# Altium schematic sheet DAC and MIC .SchDoc
size A3; Scale: 1:1; Author: Vishal Y. Bajaj; SheetNumber: 8; SheetTotal: 11; Template: A3
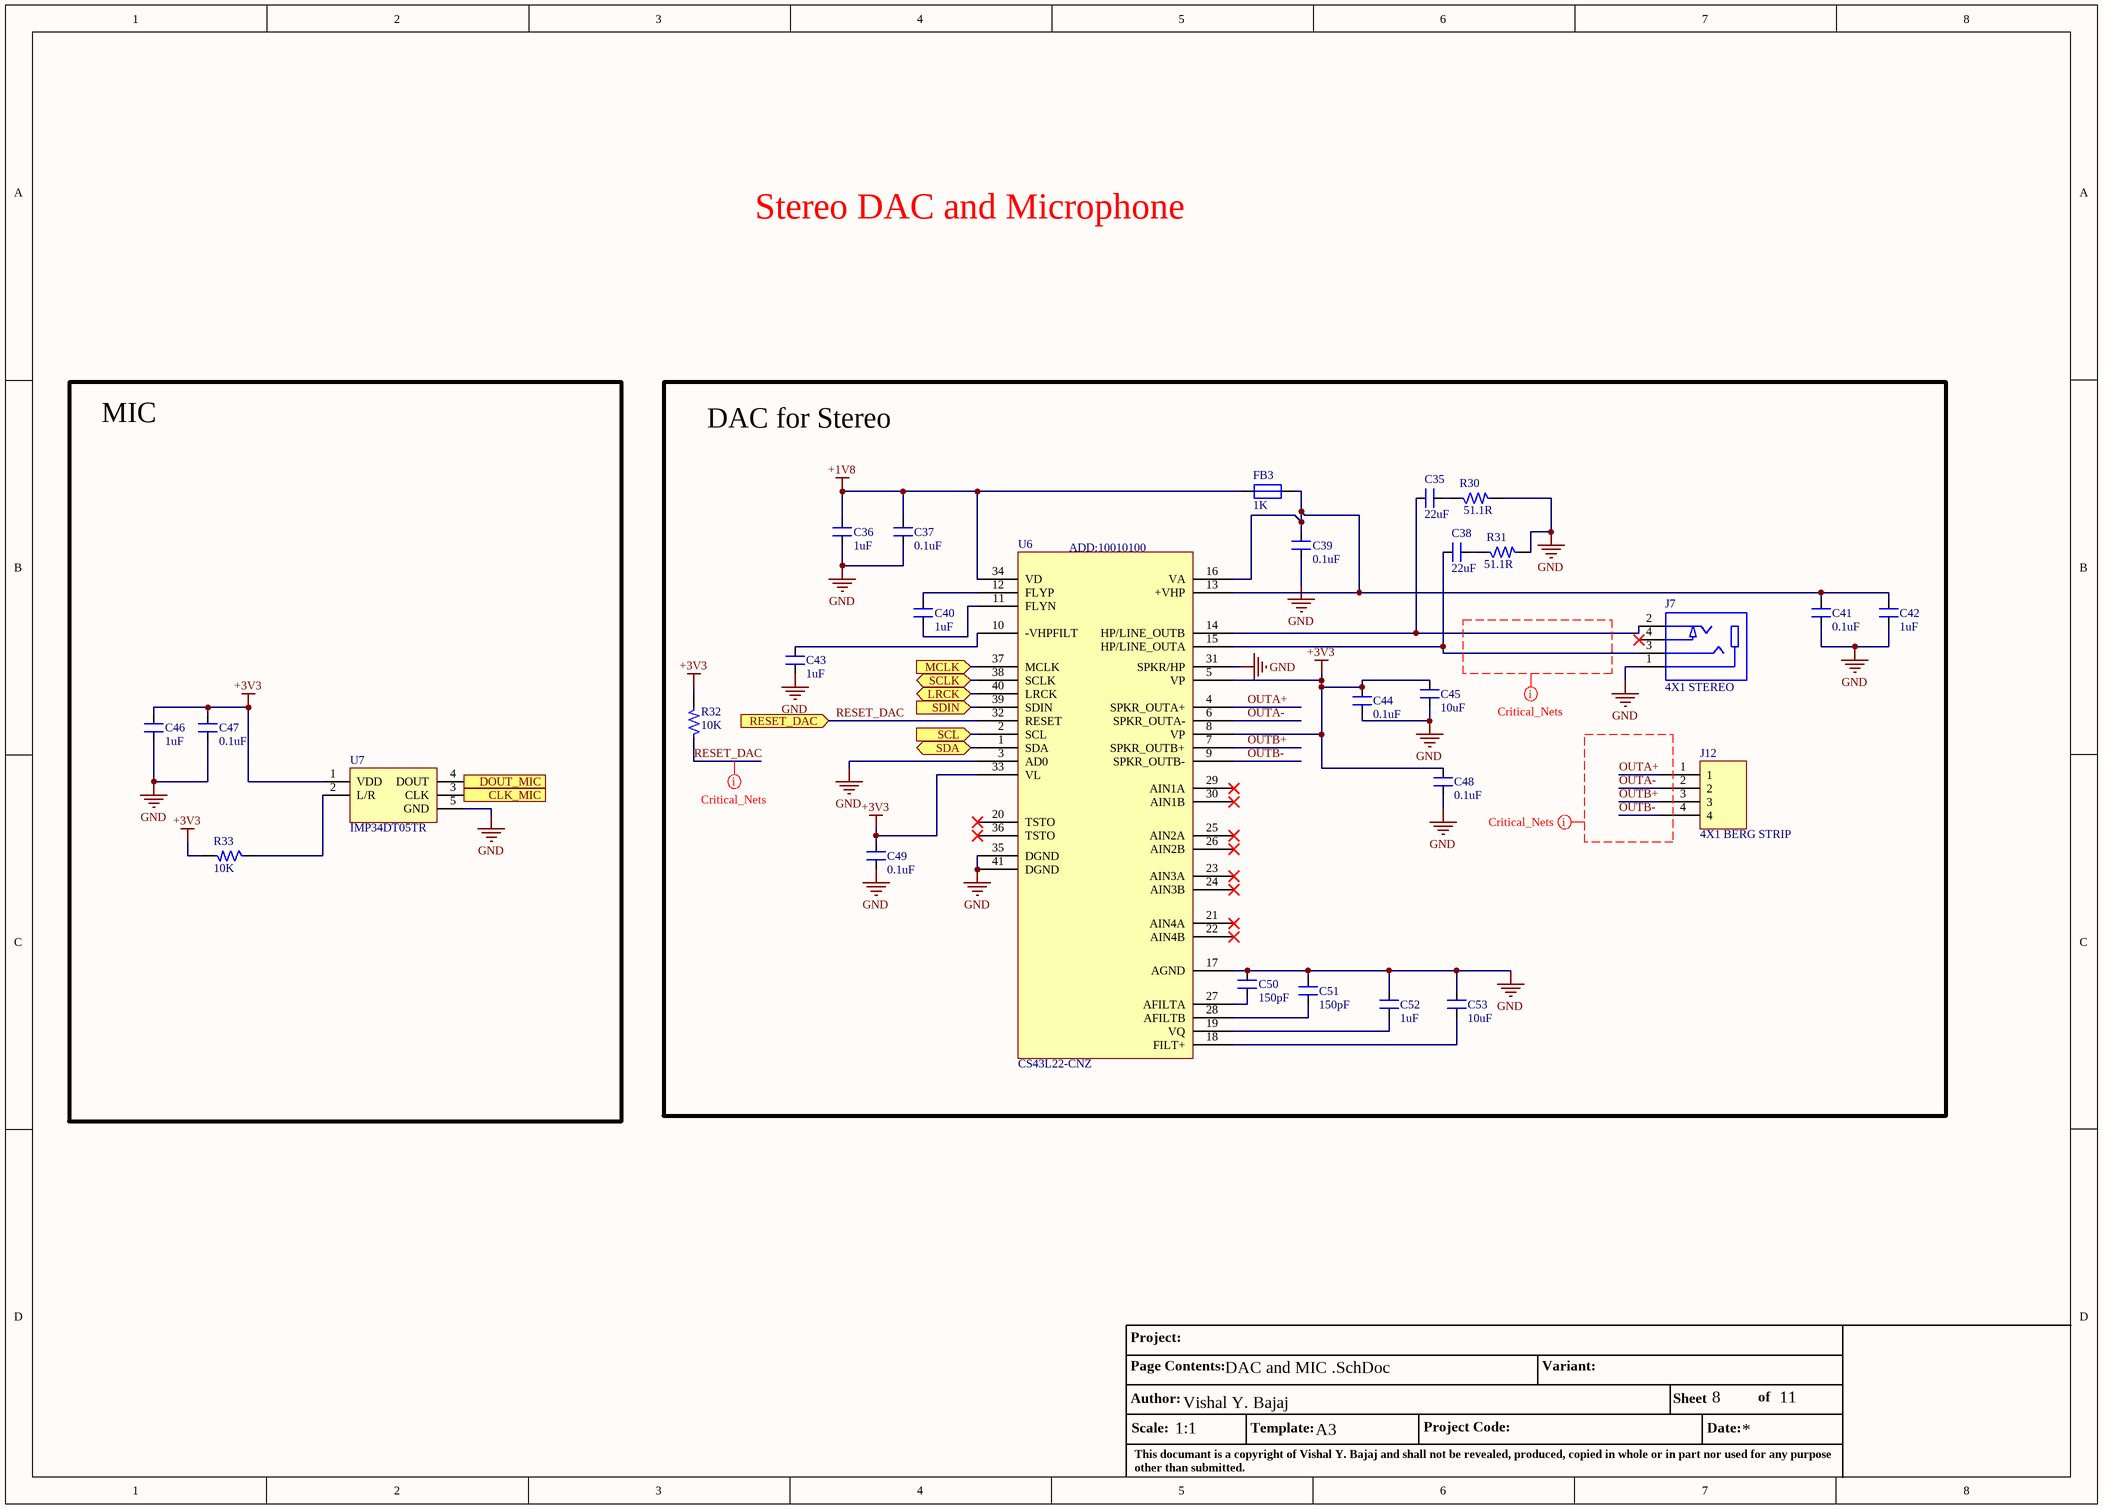
[diagram p0: DAC and MIC .SchDoc]

## Parts
C35  22uF  [CAP_0805]
C36  1uF  [CAP_0805]
C37  0.1uF  [CAP_0805]
C38  22uF  [CAP_0805]
C39  0.1uF  [CAP_0805]
C40  1uF  [CAP_0805]
C41  0.1uF  [CAP_0805]
C42  1uF  [CAP_0805]
C43  1uF  [CAP_0805]
C44  0.1uF  [CAP_0805]
C45  10uF  [CAP_1206]
C46  1uF  [CAP_0805]
C47  0.1uF  [CAP_0805]
C48  0.1uF  [CAP_0805]
C49  0.1uF  [CAP_0805]
C50  150pF  [CAP_0805]
C51  150pF  [CAP_0805]
C52  1uF  [CAP_0805]
C53  10uF  [CAP_1206]
FB3  1K  [IND_0805]
J7  4X1 STEREO  [CON_SJ-2504A-SMT-TR_SMD]
J12  4X1 BERG STRIP  [CON4_100_40D72_TH_ST_MALE]
R30  51.1R  [RES_0603]
R31  51.1R  [RES_0603]
R32  10K  [RES_0805]
R33  10K  [RES_0805]
U6  CS43L22-CNZ  [QFN40_19_284_33X9_SMD]
U7  IMP34DT05TR  [HCLGA-4_53_137_15X37_SMD]

## Blocks framed on the sheet
MIC: C46 C47 R33 U7
DAC for Stereo: C35-C45 C48-C53 FB3 J7 J12 R30-R32 U6

## Ports
CLK_MIC (in), DOUT_MIC (out), LRCK (bidir), MCLK (in), RESET_DAC (in), SCL (in), SCLK (bidir), SDA (bidir), SDIN (in)

## Nets
+1V8: C36.2 C37.2 FB3.1 U6.34(VD)
+3V3: C44.2 C45.2 C46.2 C47.2 C48.2 C49.2 R32.2 R33.2 U6.5(VP) U6.8(VP) U6.33(VL) U7.1(VDD)
GND: C36.1 C37.1 C39.1 C41.1 C42.1 C43.1 C44.1 C45.1 C46.1 C47.1 C48.1 C49.1 C50.2 C51.2 C52.2 C53.2 J7.1 R30.2 R31.2 U6.3(AD0) U6.17(AGND) U6.31(SPKR/HP) U6.35(DGND) U6.41(DGND) U7.5(GND)
CLK_MIC: U7.3(CLK) ; port CLK_MIC
DOUT_MIC: U7.4(DOUT) ; port DOUT_MIC
LRCK: U6.40(LRCK) ; port LRCK
MCLK: U6.37(MCLK) ; port MCLK
OUTA+: J12.1 U6.4(SPKR_OUTA+)
OUTA-: J12.2 U6.6(SPKR_OUTA-)
OUTB+: J12.3 U6.7(SPKR_OUTB+)
OUTB-: J12.4 U6.9(SPKR_OUTB-)
RESET_DAC: R32.1 U6.32(RESET) ; port RESET_DAC
SCL: U6.2(SCL) ; port SCL
SCLK: U6.38(SCLK) ; port SCLK
SDA: U6.1(SDA) ; port SDA
SDIN: U6.39(SDIN) ; port SDIN
NetC35_1: C35.1 J7.2 U6.14(HP/LINE_OUTB)
NetC35_2: C35.2 R30.1
NetC38_1: C38.1 J7.3 U6.15(HP/LINE_OUTA)
NetC38_2: C38.2 R31.1
NetC39_2: C39.2 C41.2 C42.2 FB3.2 U6.13(+VHP) U6.16(VA)
NetC40_1: C40.1 U6.11(FLYN)
NetC40_2: C40.2 U6.12(FLYP)
NetC43_2: C43.2 U6.10(-VHPFILT)
NetC50_1: C50.1 U6.27(AFILTA)
NetC51_1: C51.1 U6.28(AFILTB)
NetC52_1: C52.1 U6.19(VQ)
NetC53_1: C53.1 U6.18(FILT+)
NetR33_1: R33.1 U7.2(L/R)

Not connected (* = marked no-connect by the designer): J7 4*; U6 20(TSTO)* 21(AIN4A)* 22(AIN4B)* 23(AIN3A)* 24(AIN3B)* 25(AIN2A)* 26(AIN2B)* 29(AIN1A)* 30(AIN1B)* 36(TSTO)*

## Layout directives
net class Critical_nets: (no net found under the mark), OUTA+, OUTA-, OUTB+, OUTB-, RESET_DAC

## Notes on the sheet
- Stereo DAC and Microphone
- (near U6) ADD:10010100
- Project:
- Page Contents:
- Variant:
- Author:
- Scale:
- Template:
- Project Code:
- Sheet
- Date:
- of
- This documant is a copyright of Vishal Y. Bajaj and shall not be revealed, produced, copied in whole or in part nor used for any purpose
  other than submitted.

## Library data of the parts
C35 C38 = CAP_22uF-25V-20%-0805: 22µF ±20% 25V Ceramic Capacitor X5R 0805 (2012 Metric) /; Manufacturer: Murata; Manufacturer Part Number: GRM21BR61E226ME44L; Alternate Part Number-1: NA; Case/Package: 0805; Supplier-1: LCSC; Supplier Part Number-1: C86816
C36 C40 C42 C43 C46 C52 = CAP_1uF-50V-5%-0805: 1µF ±5% 50V Ceramic Capacitor X7R 0805 (2012 Metric) /; Manufacturer: Samsung; Manufacturer Part Number: CC0805JKX7R9BB105; Alternate Part Number-1: 0805F105M500NT; Case/Package: 0805; Supplier-1: SIRICOM; Supplier Part Number-1: CL21B105KBFNNNE
C37 C39 C41 C44 C47-C49 = CAP_0.1uF-50V-5%-0805: 0.1µF ±5% 50V Ceramic Capacitor X7R 0805 (2012 Metric) /; Manufacturer: AVX Corporation; Manufacturer Part Number: 08055C104JAT4A; Alternate Part Number-1: 0805B104M500; Case/Package: 0805; Supplier-1: SIRICOM; Supplier Part Number-1: 0805B104J500CT
C45 C53 = CAP_10uF-50V-10%-1206: 10µF ±10% 50V Ceramic Capacitor X7R 1206 (3216 Metric) /; Manufacturer: KEMET; Manufacturer Part Number: CL31B106KBHNNNE; Alternate Part Number-1: GRT31CR61H106ME01L; Case/Package: 1206; Supplier-1: SIRICOM; Supplier Part Number-1: CC1206KKX5R9BB106
C50 C51 = CAP_150pF-50V-10%-0805: 150pF ±10% 50V Ceramic Capacitor C0G, NP0 0805 (2012 Metric) /; Manufacturer: AVX Corporation; Manufacturer Part Number: 08055A151KAT2A; Alternate Part Number-1: NA; Case/Package: 0805; Supplier-1: Digikey; Supplier Part Number-1: 478-10501-1-ND - Cut Tape (CT)
FB3 = FB_1K-100MHZ-1.6A-0805: 1 kOhms @ 100MHz 1 Power Line Ferrite Bead 0805 (2012 Metric) 1.6A; Manufacturer: Laird; Manufacturer Part Number: BLM21SP102SH1D; Alternate Part Number-1: NA; Case/Package: 0805; Supplier-1: SIRICOM; Supplier Part Number-1: ACMS201209A102
J7 = CON-PLG-STEREO_4X1-100-RA-SMD: 2.50mm (0.094", 3/32", Sub Mini, Miniature) - Headphone Phone Jack Stereo (4 Conductor, TRRS) Connector Solder; Manufacturer: CUI Devices; Manufacturer Part Number: SJ-2504A-SMT-TR; Alternate Part Number-1: NA; Case/Package: SMD; Supplier Part Number-1: CP-SJ-2504A-SMT-CT-ND - Cut Tape (CT); Supplier-1: Digikey
J12 = CON-BS-PLG_4X1-100-ST-TH: 4 Pins, 1 Row 2.54mm Pitch, Straight bergstrip, Male; Manufacturer: NA; Manufacturer Part Number: NA; Case/Package: TH-CON; Supplier-1: SP ROAD; Supplier Part Number-1: NA; Alternate Part Number-1: NA
R30 R31 = RES_51.1R-0.1W-1%-0603: 51.1 Ohms ±1% 0.1W, 1/10W Chip Resistor 0603 (1608 Metric) Thick Film /; Manufacturer: Vishay Dale; Manufacturer Part Number: CRCW060351R1FKEAC; Alternate Part Number-1: NA; Case/Package: 0603; Supplier-1: Digikey; Supplier Part Number-1: 541-5468-1-ND - Cut Tape (CT)
R32 R33 = RES_10K-0.125W-1%-0805: 10 kOhms ±1% 0.125W, 1/8W Chip Resistor 0805 (2012 Metric) Automotive AEC-Q200 Thick Film /; Manufacturer: CTS; Manufacturer Part Number: WR08X1002FTL; Case/Package: 0805; Supplier-1: SIRICOM; Supplier Part Number-1: WR08X1002FTL; Alternate Part Number-1: WR08X1002FTL
U6 = IC_CS43L22: Audio D/A Converter ICs Low Power Stereo DAC w/ClassD Spkr Driver; Manufacturer: Cirrus Logic; Alternate Part Number-1: NA; Manufacturer Part Number: CS43L22-CNZ; Case/Package: QFN-40; Supplier-1: Mouser; Supplier Part Number-1: 777-CS43L22-CNZ
U7 = IC_IMP34DT05TR: MEMS Microphones AUTO & INDUSTRIAL SENSORS; Manufacturer: STMicroelectronics; Alternate Part Number-1: NA; Manufacturer Part Number: IMP34DT05TR; Case/Package: HCLGA-4; Supplier-1: Mouser; Supplier Part Number-1: 511-IMP34DT05TR